# Altium schematic sheet 2_PWR_BUCK.schdoc
size 304 x 205 mm; Symbol: Altium_A4; Device: Altium_A4
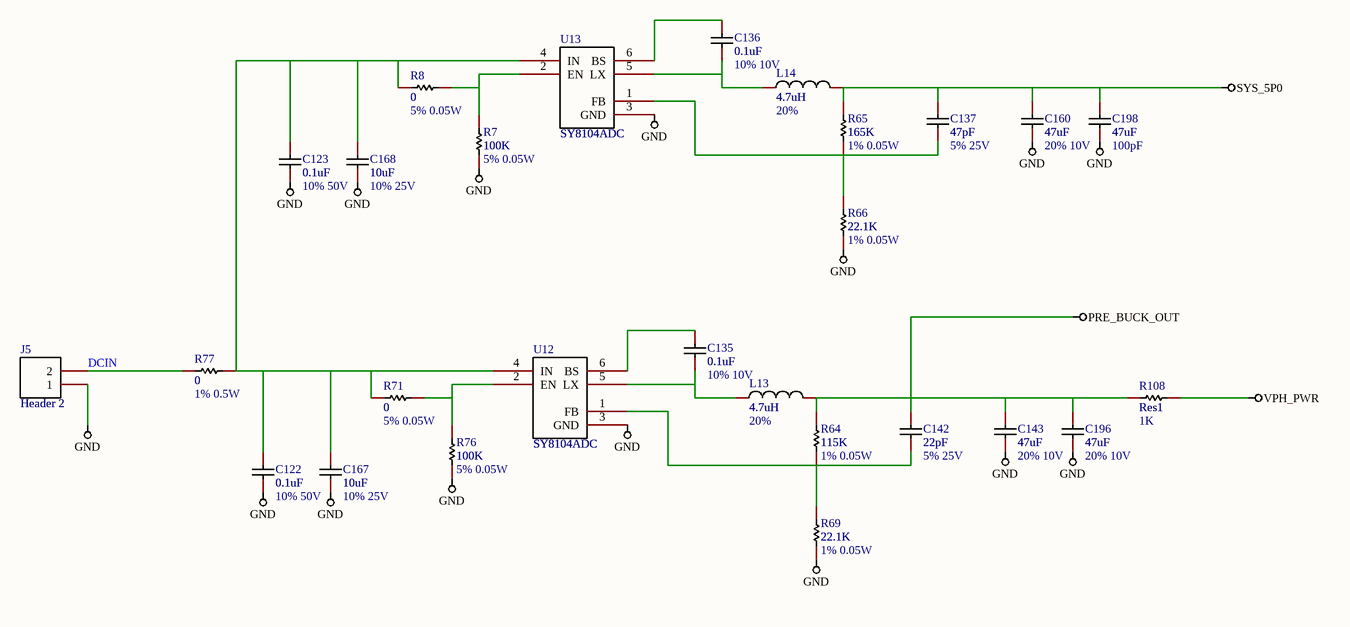
[diagram p0: 2_PWR_BUCK.schdoc]

## Parts
C122  0.1uF  value 10% 50V
C123  0.1uF  value 10% 50V
C135  0.1uF  value 10% 10V
C136  0.1uF  value 10% 10V
C137  47pF  value 5% 25V
C142  22pF  value 5% 25V
C143  47uF  value 20% 10V
C160  47uF  value 20% 10V
C167  10uF  value 10% 25V
C168  10uF  value 10% 25V
C196  47uF  value 20% 10V
C198  47uF  value 100pF
J5  Header 2
L13  4.7uH  value 20%
L14  4.7uH  value 20%
R7  100K  value 5% 0.05W
R8  0  value 5% 0.05W
R64  115K  value 1% 0.05W
R65  165K  value 1% 0.05W
R66  22.1K  value 1% 0.05W
R69  22.1K  value 1% 0.05W
R71  0  value 5% 0.05W
R76  100K  value 5% 0.05W
R77  0  value 1% 0.5W
R108  Res1  value 1K
U12  SY8104ADC
U13  SY8104ADC

## Nets
GND: C122.1 C123.1 C143.1 C160.1 C167.1 C168.1 C196.1 C198.1 J5.1 R7.1 R66.1 R69.1 R76.1 U12.3(GND) U13.3(GND)
PRE_BUCK_OUT: C142.2 C143.2 C196.2 L13.2 R64.2 R108.1
SYS_5P0: C137.2 C160.2 C198.2 L14.2 R65.2
VPH_PWR: R108.2
DCIN: J5.2 R77.1
NetC122_2: C122.2 C123.2 C167.2 C168.2 R8.1 R71.1 R77.2 U12.4(IN) U13.4(IN)
NetC135_1: C135.1 L13.1 U12.5(LX)
NetC135_2: C135.2 U12.6(BS)
NetC136_1: C136.1 L14.1 U13.5(LX)
NetC136_2: C136.2 U13.6(BS)
NetC137_1: C137.1 R65.1 R66.2 U13.1(FB)
NetC142_1: C142.1 R64.1 R69.2 U12.1(FB)
NetR7_2: R7.2 R8.2 U13.2(EN)
NetR71_2: R71.2 R76.2 U12.2(EN)

## Notes on the sheet
- 1
- 2
- 3
- 4
- 5
- 6
- A
- B
- C
- Title
- D
- Size
- A4
- Number
- Revision
- File:
- Date:
- Drawn By:
- Sheet
- Of

## Library data of the parts
C122 C123 C135 C136 = 0.1uF: Capacitor; Symbol: Cap; Add into BOM: yes; Origin Footprint: RAD-0.3; Name: 0.1uF; Device: 0.1uF; Published: 8-Jun-2000; LatestRevisionDate: 17-Jul-2002; LatestRevisionNote: Re-released for DXP Platform.; PackageReference: RAD-0.3; Publisher: Altium Limited; PackageDescription: Radial Cap, Thru-Hole; 2 Leads; 0.3 in Pin Spacing; Convert to PCB: yes; Design Item ID: Cap; Library Name: Miscellaneous Devices
C137 = 47pF: Capacitor; Symbol: Cap; Add into BOM: yes; Origin Footprint: RAD-0.3; Name: 47pF; Device: 47pF; Published: 8-Jun-2000; LatestRevisionDate: 17-Jul-2002; LatestRevisionNote: Re-released for DXP Platform.; PackageReference: RAD-0.3; Publisher: Altium Limited; PackageDescription: Radial Cap, Thru-Hole; 2 Leads; 0.3 in Pin Spacing; Convert to PCB: yes; Design Item ID: Cap; Library Name: Miscellaneous Devices
C142 = 22pF: Capacitor; Symbol: Cap; Add into BOM: yes; Origin Footprint: RAD-0.3; Name: 22pF; Device: 22pF; Published: 8-Jun-2000; LatestRevisionDate: 17-Jul-2002; LatestRevisionNote: Re-released for DXP Platform.; PackageReference: RAD-0.3; Publisher: Altium Limited; PackageDescription: Radial Cap, Thru-Hole; 2 Leads; 0.3 in Pin Spacing; Convert to PCB: yes; Design Item ID: Cap; Library Name: Miscellaneous Devices
C143 C160 C196 C198 = 47uF: Capacitor; Symbol: Cap; Add into BOM: yes; Origin Footprint: RAD-0.3; Name: 47uF; Device: 47uF; Published: 8-Jun-2000; LatestRevisionDate: 17-Jul-2002; LatestRevisionNote: Re-released for DXP Platform.; PackageReference: RAD-0.3; Publisher: Altium Limited; PackageDescription: Radial Cap, Thru-Hole; 2 Leads; 0.3 in Pin Spacing; Convert to PCB: yes; Design Item ID: Cap; Library Name: Miscellaneous Devices
C167 C168 = 10uF: Capacitor; Symbol: Cap; Add into BOM: yes; Origin Footprint: RAD-0.3; Name: 10uF; Device: 10uF; Published: 8-Jun-2000; LatestRevisionDate: 17-Jul-2002; LatestRevisionNote: Re-released for DXP Platform.; PackageReference: RAD-0.3; Publisher: Altium Limited; PackageDescription: Radial Cap, Thru-Hole; 2 Leads; 0.3 in Pin Spacing; Convert to PCB: yes; Design Item ID: Cap; Library Name: Miscellaneous Devices
J5 = Header 2: Header, 2-Pin; Add into BOM: yes; Origin Footprint: HDR1X2; Name: Header 2; Symbol: Header 2; Device: Header 2; LatestRevisionDate: 17-Jul-2002; LatestRevisionNote: Re-released for DXP Platform.; Publisher: Altium Limited; Convert to PCB: yes; Design Item ID: Header 2; Library Name: Miscellaneous Connectors
L13 L14 = 4.7uH: Inductor; Code_IEC: 1005; Origin Footprint 2: INDC1608L; Origin Footprint 3: 2029; Origin Footprint 4: 0603; Origin Footprint 5: INDC3216; Origin Footprint 6: INDC4532; Add into BOM: yes; Origin Footprint 1: 0402-A; Name: 4.7uH; Symbol: Inductor; Device: 4.7uH; Published: 8-Jun-2000; LatestRevisionDate: 29-May-2009; LatestRevisionNote: IPC-7351 Footprint Added.; PackageReference: 0402-A; Publisher: Altium Limited; PackageDescription: Chip Inductor; Code_JEITA: 0402; Convert to PCB: yes; Design Item ID: Inductor; Library Name: Miscellaneous Devices
R7 R76 = 100K: Resistor; Symbol: Res1; Add into BOM: yes; Origin Footprint: AXIAL-0.3; Name: 100K; Device: 100K; Published: 8-Jun-2000; LatestRevisionDate: 17-Jul-2002; LatestRevisionNote: Re-released for DXP Platform.; PackageReference: AXIAL-0.3; Publisher: Altium Limited; PackageDescription: Axial Device, Thru-Hole; 2 Leads; 0.3 in Pin Spacing; Convert to PCB: yes; Design Item ID: Res1; Library Name: Miscellaneous Devices
R8 R71 R77 = 0: Resistor; Symbol: Res1; Add into BOM: yes; Origin Footprint: AXIAL-0.3; Name: 0; Device: 0; Published: 8-Jun-2000; LatestRevisionDate: 17-Jul-2002; LatestRevisionNote: Re-released for DXP Platform.; PackageReference: AXIAL-0.3; Publisher: Altium Limited; PackageDescription: Axial Device, Thru-Hole; 2 Leads; 0.3 in Pin Spacing; Convert to PCB: yes; Design Item ID: Res1; Library Name: Miscellaneous Devices
R64 = 115K: Resistor; Symbol: Res1; Add into BOM: yes; Origin Footprint: AXIAL-0.3; Name: 115K; Device: 115K; Published: 8-Jun-2000; LatestRevisionDate: 17-Jul-2002; LatestRevisionNote: Re-released for DXP Platform.; PackageReference: AXIAL-0.3; Publisher: Altium Limited; PackageDescription: Axial Device, Thru-Hole; 2 Leads; 0.3 in Pin Spacing; Convert to PCB: yes; Design Item ID: Res1; Library Name: Miscellaneous Devices
R65 = 165K: Resistor; Symbol: Res1; Add into BOM: yes; Origin Footprint: AXIAL-0.3; Name: 165K; Device: 165K; Published: 8-Jun-2000; LatestRevisionDate: 17-Jul-2002; LatestRevisionNote: Re-released for DXP Platform.; PackageReference: AXIAL-0.3; Publisher: Altium Limited; PackageDescription: Axial Device, Thru-Hole; 2 Leads; 0.3 in Pin Spacing; Convert to PCB: yes; Design Item ID: Res1; Library Name: Miscellaneous Devices
R66 R69 = 22.1K: Resistor; Symbol: Res1; Add into BOM: yes; Origin Footprint: AXIAL-0.3; Name: 22.1K; Device: 22.1K; Published: 8-Jun-2000; LatestRevisionDate: 17-Jul-2002; LatestRevisionNote: Re-released for DXP Platform.; PackageReference: AXIAL-0.3; Publisher: Altium Limited; PackageDescription: Axial Device, Thru-Hole; 2 Leads; 0.3 in Pin Spacing; Convert to PCB: yes; Design Item ID: Res1; Library Name: Miscellaneous Devices
R108 = Res1: Resistor; Add into BOM: yes; Origin Footprint: AXIAL-0.3; Name: Res1; Symbol: Res1; Device: Res1; Published: 8-Jun-2000; LatestRevisionDate: 17-Jul-2002; LatestRevisionNote: Re-released for DXP Platform.; PackageReference: AXIAL-0.3; Publisher: Altium Limited; PackageDescription: Axial Device, Thru-Hole; 2 Leads; 0.3 in Pin Spacing; Convert to PCB: yes; Design Item ID: Res1; Library Name: Miscellaneous Devices
U12 U13 = SY8104ADC: Add into BOM: yes; Name: SY8104ADC; Symbol: SY8104ADC; Device: SY8104ADC; Convert to PCB: yes; Origin Footprint: SY8104ADC; Design Item ID: SY8104ADC; Library Name: MSM8916_DRAM_PMIC_REF_Library